# Altium schematic sheet IB_V2_MCU.SchDoc
size A2; SheetNumber: 2; SheetTotal: 5
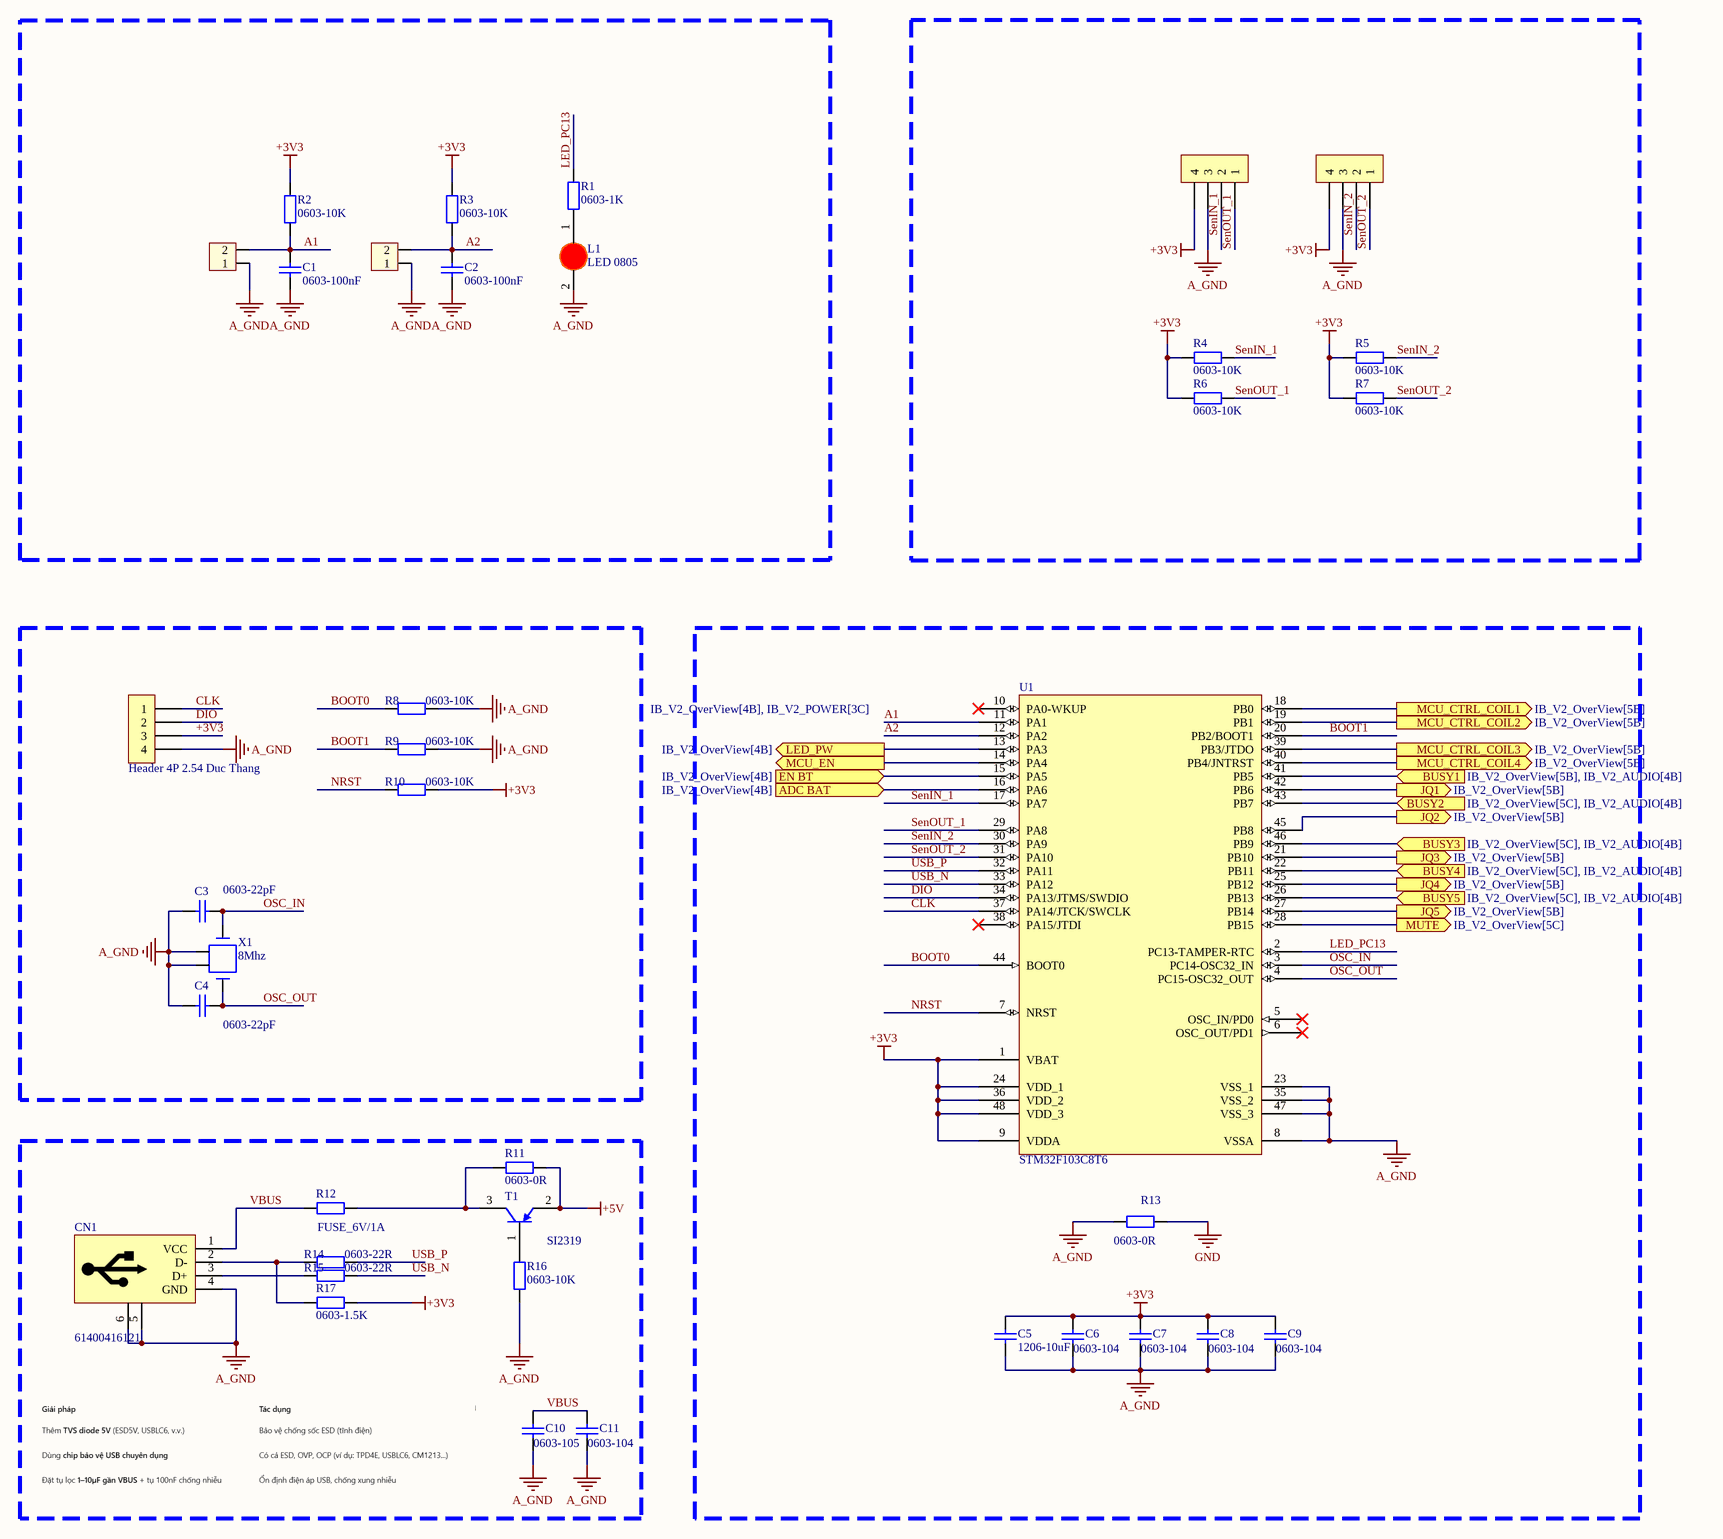
[diagram p0: IB_V2_MCU.SchDoc]

## Parts
C1  0603-100nF  [Cap 0603]
C2  0603-100nF  [Cap 0603]
C3  0603-22pF  [Cap 0603]
C4  0603-22pF  [Cap 0603]
C5  1206-10uF  [Cap 1206]
C6  0603-104  [Cap 0603]
C7  0603-104  [Cap 0603]
C8  0603-104  [Cap 0603]
C9  0603-104  [Cap 0603]
C10  0603-105  [Cap 0603]
C11  0603-104  [Cap 0603]
CN1  61400416121  [USB-B_61400416121]
H1  Header 4P 2.54 Duc Thang  [XH2.54M-4]  (value not drawn)
H2  Header 4P 2.54 Duc Thang  [XH2.54M-4]  (value not drawn)
H3  Header 2P 2.54 Duc Thang  [XH2.54M-2]  (value not drawn)
H4  Header 2P 2.54 Duc Thang  [XH2.54M-2]  (value not drawn)
H5  Header 4P 2.54 Duc Thang  [XH2.54M-4]
L1  LED 0805  [LED-0805-Red]
R1  0603-1K  [RES 0603]
R2  0603-10K  [RES 0603]
R3  0603-10K  [RES 0603]
R4  0603-10K  [RES 0603]
R5  0603-10K  [RES 0603]
R6  0603-10K  [RES 0603]
R7  0603-10K  [RES 0603]
R8  0603-10K  [RES 0603]
R9  0603-10K  [RES 0603]
R10  0603-10K  [RES 0603]
R11  0603-0R  [RES 0603]
R12  FUSE_6V/1A  [tro smd 1206]
R13  0603-0R  [RES 0603]
R14  0603-22R  [RES 0603]
R15  0603-22R  [RES 0603]
R16  0603-10K  [RES 0603]
R17  0603-1.5K  [RES 0603]
T1  SI2319  [SOT - 23]
U1  STM32F103C8T6  [LQFP48_L]
X1  8Mhz  [XTAL_SMD5032]

## Ports
ADC BAT (in, see IB_V2_OverView[4B]), BUSY1 (in, see IB_V2_OverView[5B], IB_V2_AUDIO[4B]), BUSY2 (in, see IB_V2_OverView[5C], IB_V2_AUDIO[4B]), BUSY3 (in, see IB_V2_OverView[5C], IB_V2_AUDIO[4B]), BUSY4 (in, see IB_V2_OverView[5C], IB_V2_AUDIO[4B]), BUSY5 (in, see IB_V2_OverView[5C], IB_V2_AUDIO[4B]), EN BT (in, see IB_V2_OverView[4B]), JQ1 (out, see IB_V2_OverView[5B]), JQ2 (out, see IB_V2_OverView[5B]), JQ3 (out, see IB_V2_OverView[5B]), JQ4 (out, see IB_V2_OverView[5B]), JQ5 (out, see IB_V2_OverView[5B]), LED_PW (out, see IB_V2_OverView[4B]), MCU_CTRL_COIL1 (out, see IB_V2_OverView[5B]), MCU_CTRL_COIL2 (out, see IB_V2_OverView[5B]), MCU_CTRL_COIL3 (out, see IB_V2_OverView[5B]), MCU_CTRL_COIL4 (out, see IB_V2_OverView[5B]), MCU_EN (out, see IB_V2_OverView[4B], IB_V2_POWER[3C]), MUTE (out, see IB_V2_OverView[5C])

## Nets
+3V3: C5.1 C6.1 C7.1 C8.1 C9.1 H1.4 H2.4 H5.3 R2.2 R3.2 R4.1 R5.1 R6.1 R7.1 R10.2 R17.1 U1.1(VBAT) U1.9(VDDA) U1.24(VDD_1) U1.36(VDD_2) U1.48(VDD_3)
+5V: R11.1 T1.2(E)
A_GND: C1.2 C2.2 C3.1 C4.1 C5.2 C6.2 C7.2 C8.2 C9.2 C10.2 C11.2 CN1.4(GND) CN1.5(GND) CN1.6(GND) H1.3 H2.3 H3.1 H4.1 H5.4 L1.2(K) R8.2 R9.2 R13.1 R16.2 U1.8(VSSA) U1.23(VSS_1) U1.35(VSS_2) U1.47(VSS_3) X1.2(GND) X1.4(GND)
GND: R13.2
A1: C1.1 H3.2 R2.1 U1.11(PA1)
A2: C2.1 H4.2 R3.1 U1.12(PA2)
ADC BAT: U1.16(PA6) ; port ADC BAT
BOOT0: R8.1 U1.44(BOOT0)
BOOT1: R9.1 U1.20(PB2/BOOT1)
BUSY1: U1.41(PB5) ; port BUSY1
BUSY2: U1.43(PB7) ; port BUSY2
BUSY3: U1.46(PB9) ; port BUSY3
BUSY4: U1.22(PB11) ; port BUSY4
BUSY5: U1.26(PB13) ; port BUSY5
CLK: H5.1 U1.37(PA14/JTCK/SWCLK)
DIO: H5.2 U1.34(PA13/JTMS/SWDIO)
EN BT: U1.15(PA5) ; port EN BT
JQ1: U1.42(PB6) ; port JQ1
JQ2: U1.45(PB8) ; port JQ2
JQ3: U1.21(PB10) ; port JQ3
JQ4: U1.25(PB12) ; port JQ4
JQ5: U1.27(PB14) ; port JQ5
LED_PC13: R1.2 U1.2(PC13-TAMPER-RTC)
LED_PW: U1.13(PA3) ; port LED_PW
MCU_CTRL_COIL1: U1.18(PB0) ; port MCU_CTRL_COIL1
MCU_CTRL_COIL2: U1.19(PB1) ; port MCU_CTRL_COIL2
MCU_CTRL_COIL3: U1.39(PB3/JTDO) ; port MCU_CTRL_COIL3
MCU_CTRL_COIL4: U1.40(PB4/JNTRST) ; port MCU_CTRL_COIL4
MCU_EN: U1.14(PA4) ; port MCU_EN
MUTE: U1.28(PB15) ; port MUTE
NRST: R10.1 U1.7(NRST)
OSC_IN: C3.2 U1.3(PC14-OSC32_IN) X1.1(OSC1)
OSC_OUT: C4.2 U1.4(PC15-OSC32_OUT) X1.3(OSC2)
SenIN_1: H1.2 R4.2 U1.17(PA7)
SenIN_2: H2.2 R5.2 U1.30(PA9)
SenOUT_1: H1.1 R6.2 U1.29(PA8)
SenOUT_2: H2.1 R7.2 U1.31(PA10)
USB_N: R15.2 U1.33(PA12)
USB_P: R14.2 U1.32(PA11)
VBUS: C10.1 C11.1 CN1.1(VCC) R12.1
NetCN1_2: CN1.2(D-) R14.1 R17.2
NetCN1_3: CN1.3(D+) R15.1
NetL1_1: L1.1(A) R1.1
NetR11_2: R11.2 R12.2 T1.3(C)
NetR16_1: R16.1 T1.1(B)

Not connected (* = marked no-connect by the designer): U1 5(OSC_IN/PD0)* 6(OSC_OUT/PD1)* 10(PA0-WKUP)* 38(PA15/JTDI)*

## Library data of the parts
C1 C2 C6-C11 = Cap 0603 100nF: 50V 100nF X7R ±5% 0603 Multilayer Ceramic Capacitors MLCC - SMD/SMT ROHS; ComponentLink1Description: LCSC ref link; ComponentLink1URL: https://www.lcsc.com/product-detail/Multilayer-Ceramic-Capacitors-MLCC-SMD-SMT_YAGEO-CC0603JRX7R9BB104_C91183.html?s_z=n_100nF%25200603%2520cap%252050v; Package: 0603
C3 C4 = Cap 0603 22pF: 50V 22pF C0G ±5% 0603 Multilayer Ceramic Capacitors MLCC - SMD/SMT ROHS; ComponentLink1Description: LCSC ref link; ComponentLink1URL: https://www.lcsc.com/product-detail/Multilayer-Ceramic-Capacitors-MLCC-SMD-SMT_Samsung-Electro-Mechanics-CL10C220JB8NNNC_C1653.html?s_z=n_22pF%25200603%2520cap%252050v; Package: 0603
C5 = Cap 1206 10uF: 50V 10uF X5R ±10% 1206 Multilayer Ceramic Capacitors MLCC - SMD/SMT ROHS; Package: 1206; ComponentLink1Description: LCSC ref link; ComponentLink1URL: https://www.lcsc.com/product-detail/Multilayer-Ceramic-Capacitors-MLCC-SMD-SMT_Samsung-Electro-Mechanics-CL31A106KBHNNNE_C13585.html?s_z=n_10uF%25201206%2520cap%252050v
CN1 = USB_61400416121: CONN COM TYPE B USB HORZ 4POS; Manufacturer: Wurth Electronics Inc.; Connector Type: USB - B; Number of Contacts: 4; Gender: Receptacle; Specifications: USB 2.0; Current Rating: 1.5A; Voltage - Rated: 30V; Mating Cycles: 1500; Shielding: Shielded; Material Flammability Rating: UL94 V-0; Supplier 1: Digi-Key; Manufacturer Part Number: 61400416121; RoHS: RoHS Compliant; Category: Connectors, Interconnects; Stock 1: 3084; Pricing 1: 1=1.32, 10=1.165, 50=1.098, 100=0.986, 250=0.896 (USD); Packaging: Tray; Part Status: Active; Mounting Type: Through Hole, Right Angle; Mounting Feature: Horizontal; Termination: Solder; Features: Board Lock; Ingress Protection: -; Operating Temperature: -40°C ~ 105°C; Contact Finish: Gold; Shell/Shielding Material: Brass; Insulation Color: White; ComponentLink1URL: http://katalog.we-online.de/em/datasheet/61400416121.pdf; ComponentLink1Description: http://katalog.we-online.de/em/datasheet/61400416121.pdf; Supplier Part Number 1: 732-2108-ND
H1 H2 H5 = Header 4P 2.54 Duc Thang: Cắm; Ten_Linh_Kien: Header 4P XH2.54-4P Đực Thẳng; Don_Vi: Con; Ma_Hang: MH001285; Chung_Loai: Cắm
H3 H4 = Header 2P 2.54 Duc Thang: Cắm; Ten_Linh_Kien: Header 2P XH2.54-2P Đực Thẳng; Don_Vi: Con; Ma_Hang: MH001283; Chung_Loai: Cắm
L1 = LED 0805 Do: Dán; Don_Vi: Con; Ma_Hang: MH000897; Ten_Linh_Kien: LED 0805 Màu Đỏ (Red); Ghi_Chu: *; Kieu_Chan: *; Chung_Loai: Dán
R1-R7 = Res 0603 10K: 0.1W Thick Film Resistors 75V ±100ppm/℃ ±1% 10kΩ 0603 Chip Resistor - Surface Mount ROHS; ComponentLink1Description: LCSC ref link; ComponentLink1URL: https://www.lcsc.com/product-detail/Chip-Resistor-Surface-Mount_UNI-ROYAL-Uniroyal-Elec-0603WAF1002T5E_C25804.html?s_z=s_Resistors%257CChip%2520Resistor%2520-%2520Surface%2520Mount; Package: 0603
R8-R11 R13-R17 = Res 0603 22R: 100mW Thick Film Resistors 75V ±100ppm/℃ ±1% 22Ω 0603 Chip Resistor - Surface Mount ROHS; Package: 0603; ComponentLink1Description: LCSC ref link; ComponentLink1URL: https://www.lcsc.com/product-detail/Chip-Resistor-Surface-Mount_YAGEO-RC0603FR-0722RL_C107701.html?s_z=n_res%25200603%252022r
R12 = Tro 1206 1% 1M: Dán; Don_Vi: Con; So_Chan: 2; Ten_Linh_Kien: Trở 1206 1% 1M; Ma_Hang: MH005881; Chung_Loai: Dán; Kieu_Chan: *
T1 = Transistor - A1015: P-Channel 40-V(D-S) MOSEFET / SOT-23/3 LEAD
U1 = STM32F103C8T6: IC MCU 32BIT 64KB FLASH 48LQFP; Manufacturer: STMicroelectronics; Core Processor: ARM® Cortex®-M3; Core Size: 32-Bit; Speed: 72MHz; Connectivity: CAN, I²C, IrDA, LIN, SPI, UART/USART, USB; Peripherals: DMA, Motor Control PWM, PDR, POR, PVD, PWM, Temp Sensor, WDT; Program Memory Size: 64KB (64K x 8); RAM Size: 20K x 8; Voltage - Supply (Vcc/Vdd): 2 V ~ 3.6 V; Data Converters: A/D 10x12b; Oscillator Type: Internal; Supplier 1: Digi-Key; Manufacturer Part Number: STM32F103C8T6; RoHS: RoHS Compliant; Category: Integrated Circuits (ICs); Stock 1: 3588; Pricing 1: 1=6.06, 10=5.438, 100=4.4558, 500=3.7931, 1000=3.199 (USD); Packaging: Tray; Part Status: Active; Program Memory Type: FLASH; EEPROM Size: -; Operating Temperature: -40°C ~ 85°C (TA); Package / Case: 48-LQFP; Base Part Number: STM32F103; ComponentLink1URL: https://media.digikey.com/pdf/Data%20Sheets/ST%20Microelectronics%20PDFS/STM32F103x8,B.pdf; ComponentLink1Description: https://media.digikey.com/pdf/Data%20Sheets/ST%20Microelectronics%20PDFS/STM32F103x8,B.pdf; Supplier Part Number 1: 497-6063-ND
X1 = XTAL_7B-8.000MAAJ-T: CRYSTAL 8.0000MHZ 18PF SMD; Manufacturer 1: TXC CORPORATION; Category 1: Crystals, Oscillators, Resonators; Frequency Stability: ±30ppm; ESR (Equivalent Series Resistance): 100 Ohm; Operating Mode: Fundamental; Supplier 1: Digi-Key; Supplier Part Number 1: 887-1452-1-ND; Manufacturer Part Number 1: 7B-8.000MAAJ-T; RoHS 1: RoHS Compliant; Description 1: CRYSTAL 8.0000MHZ 18PF SMD; Stock 1: 21080; Pricing 1: 1=0.86, 10=0.759, 50=0.7096, 100=0.627, 500=0.594 (USD); Packaging: Cut Tape (CT); Part Status: Active; Type: MHz Crystal; Frequency: 8MHz; Frequency Tolerance: ±30ppm; Load Capacitance: 18pF; Operating Temperature: -20°C ~ 70°C; Ratings: -; Mounting Type: Surface Mount; Package / Case: 4-SMD, No Lead; Size / Dimension: 0.197" L x 0.126" W (5.00mm x 3.20mm); Height - Seated (Max): 0.041" (1.05mm); ComponentLink1URL: http://www.txccorp.com/download/products/quartz_crystals/2015TXC_7B_19.pdf; ComponentLink1Description: http://www.txccorp.com/download/products/quartz_crystals/2015TXC_7B_19.pdf